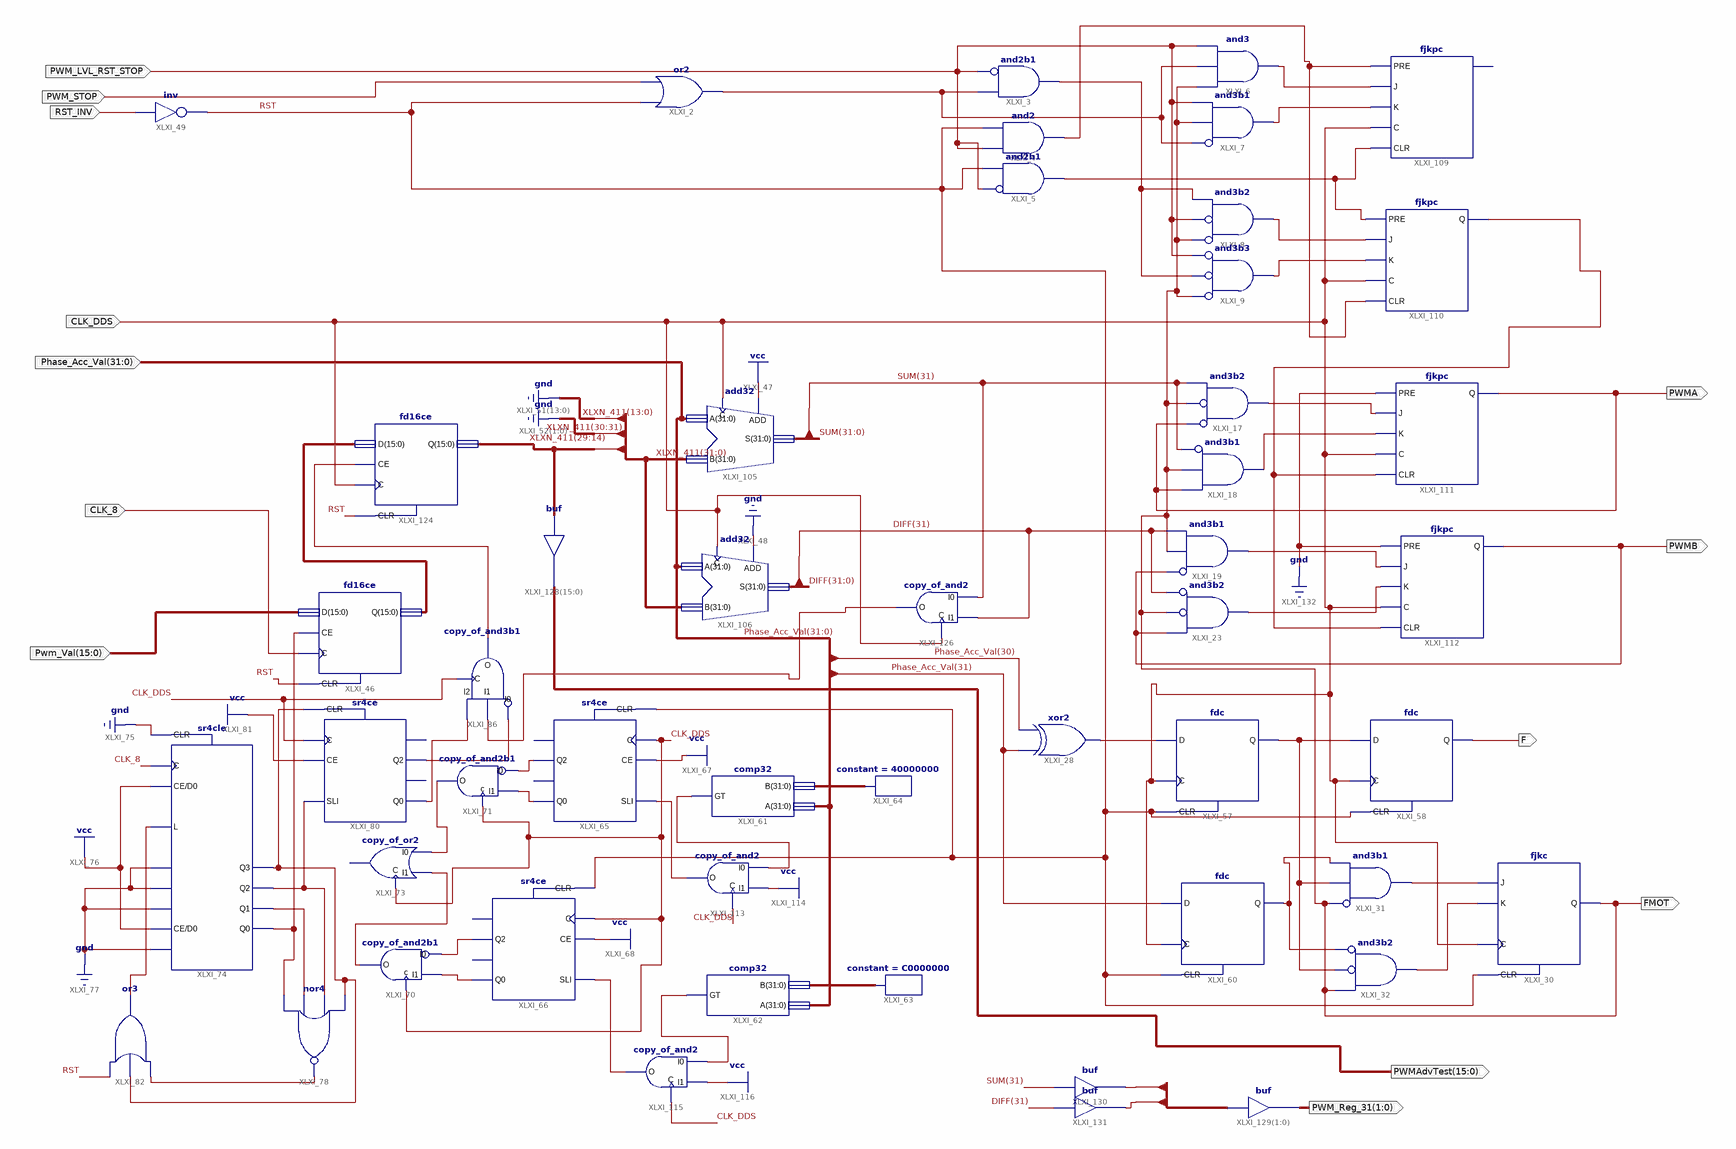
[diagram p0: schematic sheet 1]
// Xilinx ISE schematic PWMAdv.sch (spartan3a) as structural Verilog: 49 symbols, 13 ports
module PWMAdv (
  input  PWM_STOP,
  input  CLK_DDS,
  input  PWM_LVL_RST_STOP,
  input  [31:0] Phase_Acc_Val,
  input  RST_INV,
  input  [15:0] Pwm_Val,
  input  CLK_8,
  output PWMA,
  output PWMB,
  output F,
  output FMOT,
  output [15:0] PWMAdvTest,
  output [1:0] PWM_Reg_31
);

  wire RST, XLXN_24, XLXN_28, XLXN_33, XLXN_34, XLXN_35, XLXN_36, XLXN_48, XLXN_49, XLXN_55, XLXN_56,
       XLXN_163, XLXN_175, XLXN_178, XLXN_182, XLXN_183, XLXN_241, XLXN_242, XLXN_244, XLXN_245, XLXN_248,
       XLXN_249, XLXN_280, XLXN_286, XLXN_289, XLXN_293, XLXN_302, XLXN_311, XLXN_350, XLXN_357, XLXN_362,
       XLXN_375, XLXN_376, XLXN_379, XLXN_380, XLXN_418, XLXN_421, XLXN_432, XLXN_433;
  wire [1:0] XLXN_434;
  wire [15:0] XLXN_416;
  wire [29:14] XLXN_411;
  wire [31:0] DIFF, SUM, XLXN_227, XLXN_228;

  or XLXI_2 (XLXN_24, RST, PWM_STOP);
  and XLXI_3 (XLXN_28, ~PWM_LVL_RST_STOP, XLXN_24);  // and2b1
  and XLXI_4 (XLXN_357, PWM_LVL_RST_STOP, RST);
  and XLXI_5 (XLXN_350, ~PWM_LVL_RST_STOP, RST);  // and2b1
  and XLXI_6 (XLXN_33, FMOT, XLXN_24, PWM_LVL_RST_STOP);
  and XLXI_7 (XLXN_34, ~XLXN_24, FMOT, PWM_LVL_RST_STOP);  // and3b1
  and XLXI_8 (XLXN_35, ~FMOT, ~PWM_LVL_RST_STOP, XLXN_28);  // and3b2
  and XLXI_9 (XLXN_36, ~FMOT, ~XLXN_28, ~PWM_LVL_RST_STOP);  // and3b3
  and XLXI_17 (XLXN_48, ~PWMA, ~FMOT, SUM[31]);  // and3b2
  and XLXI_18 (XLXN_49, ~SUM[31], FMOT, PWMA);  // and3b1
  and XLXI_19 (XLXN_55, ~PWMB, FMOT, DIFF[31]);  // and3b1
  and XLXI_23 (XLXN_56, ~DIFF[31], ~FMOT, PWMB);  // and3b2
  xor XLXI_28 (XLXN_163, Phase_Acc_Val[31], Phase_Acc_Val[30]);
  fjkc XLXI_30 (.C(CLK_DDS), .CLR(RST), .J(XLXN_175), .K(XLXN_178), .Q(FMOT));
  and XLXI_31 (XLXN_175, ~FMOT, XLXN_183, XLXN_182);  // and3b1
  and XLXI_32 (XLXN_178, ~XLXN_182, ~XLXN_183, FMOT);  // and3b2
  not XLXI_49 (RST, RST_INV);
  fdc XLXI_57 (.C(CLK_DDS), .CLR(RST), .D(XLXN_163), .Q(XLXN_183));
  fdc XLXI_58 (.C(CLK_DDS), .CLR(RST), .D(XLXN_183), .Q(F));
  fdc XLXI_60 (.C(CLK_DDS), .CLR(RST), .D(Phase_Acc_Val[31]), .Q(XLXN_182));
  comp32 XLXI_61 (.A(Phase_Acc_Val), .B(XLXN_227), .GT(XLXN_376));
  comp32 XLXI_62 (.A(Phase_Acc_Val), .B(XLXN_228), .GT(XLXN_380));
  constant #(.CValue("C0000000")) XLXI_63 (.O(XLXN_228));
  constant #(.CValue("40000000")) XLXI_64 (.O(XLXN_227));
  sr4ce XLXI_65 (.C(CLK_DDS), .CE(1'b1), .CLR(RST), .SLI(XLXN_375), .Q0(XLXN_245), .Q2(XLXN_244));  // open: Q1, Q3
  sr4ce XLXI_66 (.C(CLK_DDS), .CE(1'b1), .CLR(RST), .SLI(XLXN_379), .Q0(XLXN_242), .Q2(XLXN_241));  // open: Q1, Q3
  copy_of_and2b1 XLXI_70 (.I0(XLXN_241), .I1(XLXN_242), .O(XLXN_249), .c(CLK_DDS));
  copy_of_and2b1 XLXI_71 (.I0(XLXN_244), .I1(XLXN_245), .O(XLXN_248), .c(CLK_DDS));
  copy_of_or2 XLXI_73 (.I0(XLXN_248), .I1(XLXN_249), .C(CLK_DDS));  // open: O
  sr4cle XLXI_74 (
    .C(CLK_8), .CE(1'b1), .CLR(1'b0), .D0(1'b1), .D1(1'b0), .D2(1'b0), .D3(1'b0), .L(XLXN_311), .SLI(1'b0),
    .Q0(XLXN_280), .Q1(XLXN_286), .Q2(XLXN_293), .Q3(XLXN_289));
  fd16ce XLXI_46 (.C(CLK_8), .CE(XLXN_280), .CLR(RST), .D(Pwm_Val), .Q(XLXN_416));
  nor XLXI_78 (XLXN_302, XLXN_280, XLXN_286, XLXN_293, XLXN_289);
  sr4ce XLXI_80 (.C(CLK_DDS), .CE(1'b1), .CLR(XLXN_289), .SLI(XLXN_293), .Q0(XLXN_433), .Q2(XLXN_432));  // open: Q1, Q3
  or XLXI_82 (XLXN_311, XLXN_302, XLXN_289, RST);
  copy_of_and3b1 XLXI_86 (.I0(XLXN_432), .I1(XLXN_421), .I2(XLXN_433), .O(XLXN_418), .C(CLK_DDS));
  add32 XLXI_105 (.A(Phase_Acc_Val), .ADD(1'b1), .B({2'b00, XLXN_411, {14{1'b0}}}), .C(CLK_DDS), .S(SUM));
  add32 XLXI_106 (.A(Phase_Acc_Val), .ADD(1'b0), .B({2'b00, XLXN_411, {14{1'b0}}}), .C(CLK_DDS), .S(DIFF));
  fjkpc XLXI_109 (.PRE(XLXN_357), .J(XLXN_33), .K(XLXN_34), .C(CLK_DDS), .CLR(XLXN_350));  // open: Q
  fjkpc XLXI_110 (.PRE(XLXN_350), .J(XLXN_35), .K(XLXN_36), .C(CLK_DDS), .Q(XLXN_362), .CLR(XLXN_357));
  fjkpc XLXI_111 (.PRE(1'b0), .J(XLXN_48), .K(XLXN_49), .C(CLK_DDS), .Q(PWMA), .CLR(XLXN_362));
  fjkpc XLXI_112 (.PRE(1'b0), .J(XLXN_55), .K(XLXN_56), .C(CLK_DDS), .Q(PWMB), .CLR(XLXN_362));
  copy_of_and2 XLXI_113 (.I0(XLXN_376), .I1(1'b1), .O(XLXN_375), .C(CLK_DDS));
  copy_of_and2 XLXI_115 (.I0(XLXN_380), .I1(1'b1), .O(XLXN_379), .C(CLK_DDS));
  fd16ce XLXI_124 (.C(CLK_DDS), .CE(XLXN_418), .CLR(RST), .D(XLXN_416), .Q(XLXN_411));
  copy_of_and2 XLXI_126 (.I0(SUM[31]), .I1(DIFF[31]), .O(XLXN_421), .C(CLK_DDS));
  assign PWMAdvTest = XLXN_411;  // buf XLXI_128[15..0], 16 bits wide
  assign PWM_Reg_31 = XLXN_434;  // buf XLXI_129[1..0], 2 bits wide
  buf XLXI_130 (XLXN_434[0], SUM[31]);
  buf XLXI_131 (XLXN_434[1], DIFF[31]);
endmodule
